# Altium schematic sheet project..SchDoc
size A; SheetNumber: 1; SheetTotal: 1; SPICEModelCacheQHMDEGTC: <root> / <DocumentId>QHMDEGTC</DocumentId> / <CacheFrame Number="0"> / <Model Name="1n4001" Kind="MDL"> / <Text>*1N4001 MCE 8-16-95 / *50V 1A Si GenPurpose Diode pkg:DIODE0.4 1,2 / .MODEL 1N4001 D(IS=2.55E-9 RS=0.042 N=1.75 TT=5.76E-6 CJO=1.85E-11 / + VJ=0.75 M=0.333 BV=50 IBV=1E-5 )</Text> / </Model> / </CacheFrame> / </root>
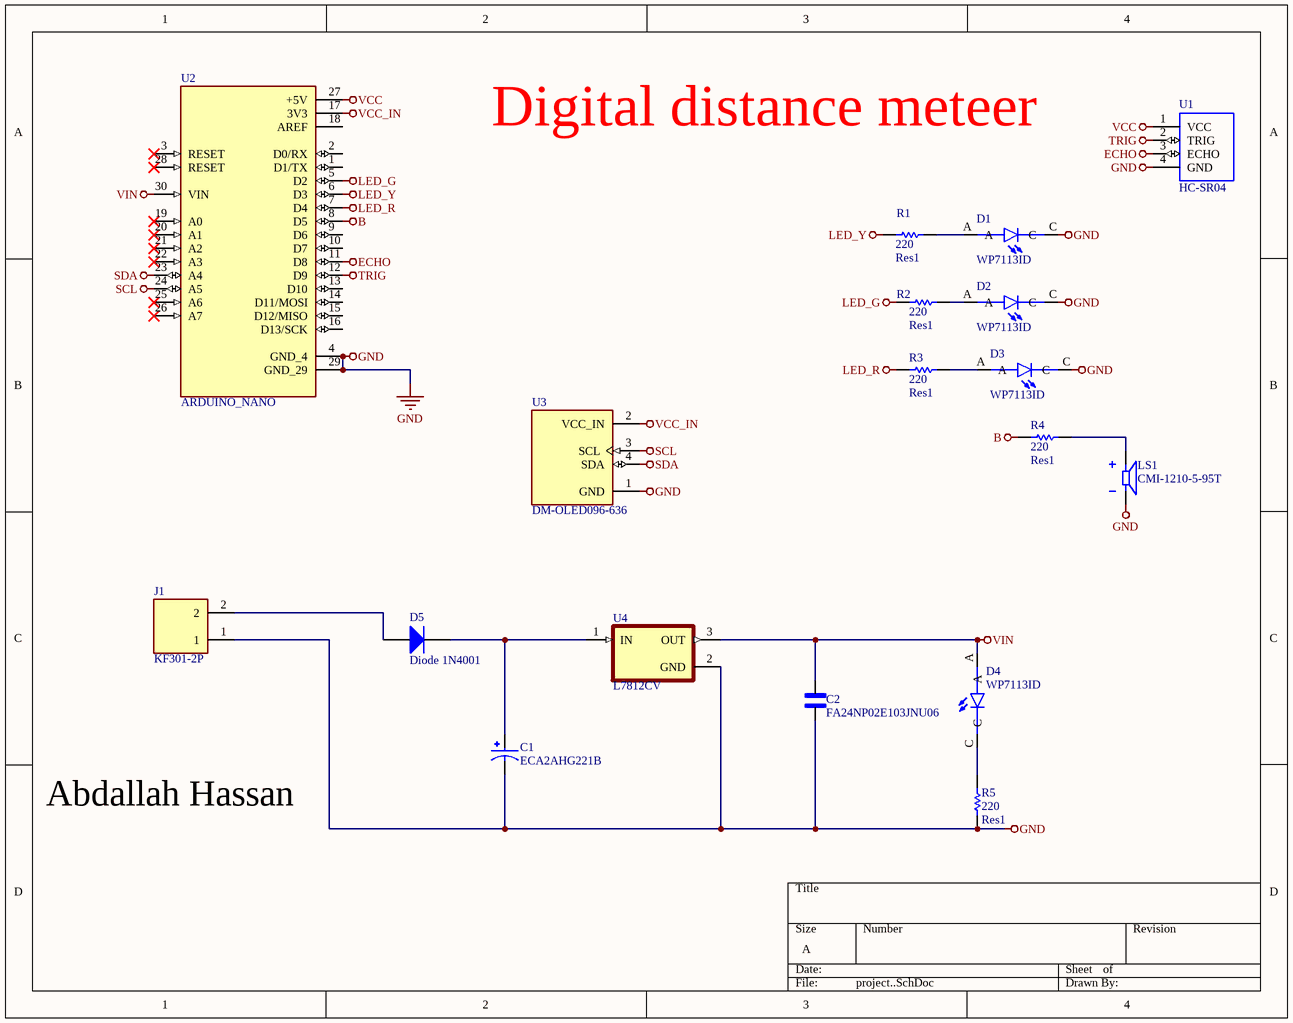
[diagram p0: project..SchDoc]

## Parts
C1  ECA2AHG221B  [CAPPRD500W60D1250H2500]
C2  FA24NP02E103JNU06  [CAPRB500W50L450T300H550]
D1  WP7113ID  [LED_WP7113ID]
D2  WP7113ID  [LED_WP7113ID]
D3  WP7113ID  [LED_WP7113ID]
D4  WP7113ID  [LED_WP7113ID]
D5  Diode 1N4001  [DO-41]
J1  KF301-2P  [HANDSON_KF301-2P]
LS1  CMI-1210-5-95T  [XDCR_CMI-1210-5-95T]
R1  Res1  value 220  [AXIAL-0.3]
R2  Res1  value 220  [AXIAL-0.3]
R3  Res1  value 220  [AXIAL-0.3]
R4  Res1  value 220  [AXIAL-0.3]
R5  Res1  value 220  [AXIAL-0.3]
U1  HC-SR04  [XCVR_HC-SR04]
U2  ARDUINO_NANO  [MODULE_ARDUINO_NANO]
U3  DM-OLED096-636  [MODULE_DM-OLED096-636]
U4  L7812CV  [TO-220-3]

## Nets
B: R4.1 U2.8(D5)
ECHO: U1.3(ECHO) U2.11(D8)
GND: C1.N C2.1 D1.C D2.C D3.C J1.1 LS1.N R5.1 U1.4(GND) U2.4(GND_4) U2.29(GND_29) U3.1(GND) U4.2(GND)
LED_G: R2.1 U2.5(D2)
LED_R: R3.1 U2.7(D4)
LED_Y: R1.1 U2.6(D3)
SCL: U2.24(A5) U3.3(SCL)
SDA: U2.23(A4) U3.4(SDA)
TRIG: U1.2(TRIG) U2.12(D9)
VCC: U1.1(VCC) U2.27(+5V)
VCC_IN: U2.17(3V3) U3.2(VCC_IN)
VIN: C2.2 D4.A U2.30(VIN) U4.3(OUT)
NetC1_P: C1.P D5.2(K) U4.1(IN)
NetD1_A: D1.A R1.2
NetD2_A: D2.A R2.2
NetD3_A: D3.A R3.2
NetD4_C: D4.C R5.2
NetD5_1: D5.1(A) J1.2
NetLS1_P: LS1.P R4.2

Not connected (* = marked no-connect by the designer): U2 1(D1/TX) 2(D0/RX) 3(RESET)* 9(D6) 10(D7) 13(D10) 14(D11/MOSI) 15(D12/MISO) 16(D13/SCK) 18(AREF) 19(A0)* 20(A1)* 21(A2)* 22(A3)* 25(A6)* 26(A7)* 28(RESET)*

## Notes on the sheet
- (near U1) Digital distance meteer
- Abdallah Hassan

## Library data of the parts
C1 = ECA2AHG221B: CAP ALUM 220UF 20% 100V RADIAL; MF: Panasonic; Value: *; MP: ECA2AHG221B; Availability: In Stock; Check_prices: https://www.snapeda.com/parts/ECA2AHG221B/Panasonic/view-part/?ref=eda; SnapEDA_Link: https://www.snapeda.com/parts/ECA2AHG221B/Panasonic/view-part/?ref=snap; Purchase-URL: https://pricing.snapeda.com/search/part/ECA2AHG221B/?ref=eda; Price: None; Package: RADIAL-2 Panasonic
C2 = FA24NP02E103JNU06: Cap Ceramic 0.01uF 250V C0G 5% Radial 5mm 150C Automotive Ammo; MF: TDK; SnapEDA_Link: https://www.snapeda.com/parts/FA24NP02E103JNU06/TDK/view-part/?ref=snap; Package: Radial TDK; Value: *; MP: FA24NP02E103JNU06; Check_prices: https://www.snapeda.com/parts/FA24NP02E103JNU06/TDK/view-part/?ref=eda
D1-D4 = WP7113ID: Red 617nm LED Indication - Discrete 2V Radial; MF: Kingbright; Price: None; MP: WP7113ID; Package: Radial Kingbright; Check_prices: https://www.snapeda.com/parts/WP7113ID/Kingbright/view-part/?ref=eda; Purchase-URL: https://pricing.snapeda.com/search/part/WP7113ID/?ref=eda; Availability: In Stock; Value: *; SnapEDA_Link: https://www.snapeda.com/parts/WP7113ID/Kingbright/view-part/?ref=snap
D5 = Diode 1N4001: 1 Amp General Purpose Rectifier; Published: 8-Jun-2000; LatestRevisionDate: 17-Jul-2002; LatestRevisionNote: Re-released for DXP Platform.; DatasheetVersion: 1998; PackageVersion: Aug-1999; PackageReference: DO-41; Publisher: Altium Limited; PackageDescription: Diode, Axial; Body 5.2 x 2.7 mm (LxDia. max), Lead Dia. 0.86 mm (max); Code_JEDEC: DO-204-AL; ComponentLink1Description: Manufacturer Link; ComponentLink1URL: http://www.fairchildsemi.com/; ComponentLink2Description: Datasheet; ComponentLink2URL: http://www.fairchildsemi.com/ds/1N%2F1N4001.pdf
J1 = KF301-2P: 2 Pin Terminal Block 5mm Pitch; MF: Handson Technology; SnapEDA_Link: https://www.snapeda.com/parts/KF301-2P/Handson+Technology/view-part/?ref=snap; Package: None; Value: *; MP: KF301-2P; Check_prices: https://www.snapeda.com/parts/KF301-2P/Handson+Technology/view-part/?ref=eda
LS1 = CMI-1210-5-95T: 12 mm, 5 Vdc, 98 dB, Through Hole, Magnetic Audio Indicator Buzzer; MF: Same Sky; SnapEDA_Link: https://www.snapeda.com/parts/CMI-1210-5-95T/Same+Sky/view-part/?ref=snap; Package: None; Value: *; MP: CMI-1210-5-95T; Check_prices: https://www.snapeda.com/parts/CMI-1210-5-95T/Same+Sky/view-part/?ref=eda
R1-R5 = Res1: Resistor; Published: 8-Jun-2000; LatestRevisionDate: 17-Jul-2002; LatestRevisionNote: Re-released for DXP Platform.; PackageReference: AXIAL-0.3; Publisher: Altium Limited; PackageDescription: Axial Device, Thru-Hole; 2 Leads; 0.3 in Pin Spacing
U1 = HC-SR04: Ultrasonic Sensor Module; Availability: Unavailable; MP: HC-SR04; Value: *; Price: None; Package: None
U2 = ARDUINO_NANO: Small, complete, and breadboard-friendly board based on the ATmega328 (Arduino Nano 3.x); SnapEDA_Link: https://www.snapeda.com/parts/Arduino%20Nano/Arduino/view-part/?ref=snap; Package: Non-Standard Arduino; Value: *; MF: Arduino; MP: Arduino Nano; Check_prices: https://www.snapeda.com/parts/Arduino%20Nano/Arduino/view-part/?ref=eda
U3 = DM-OLED096-636: 0.96â€ 128 X 64 MONOCHROME GRAPHIC OLED DISPLAY MODULE - I2C; SnapEDA_Link: https://www.snapeda.com/parts/DM-OLED096-636/Display+Module/view-part/?ref=snap; Package: Package; Value: *; MF: Display Module; MP: DM-OLED096-636; Check_prices: https://www.snapeda.com/parts/DM-OLED096-636/Display+Module/view-part/?ref=eda
U4 = L7812CV: Linear Voltage Regulator IC Positive Fixed 1 Output 1.5A TO-220; MF: STMicroelectronics; SnapEDA_Link: https://www.snapeda.com/parts/L7812CV/STMicroelectronics/view-part/?ref=snap; Package: TO-220-3 STMicroelectronics; Value: *; MP: L7812CV; Check_prices: https://www.snapeda.com/parts/L7812CV/STMicroelectronics/view-part/?ref=eda